# Altium schematic sheet 1_README.schdoc.schdoc
size 309 x 223 mm; Symbol: Sheet-Symbol_A4; Device: Sheet-Symbol_A4; Company: 嘉立创EDA; Version: V1.0; Page Size: A4; @Project Name: 偏控器件; @Page Count: 5; @Update Date: 2025-09-26; @Create Date: 2025-09-18; @Schematic Name: Schematic1; @Page No: 1; @Page Name: README
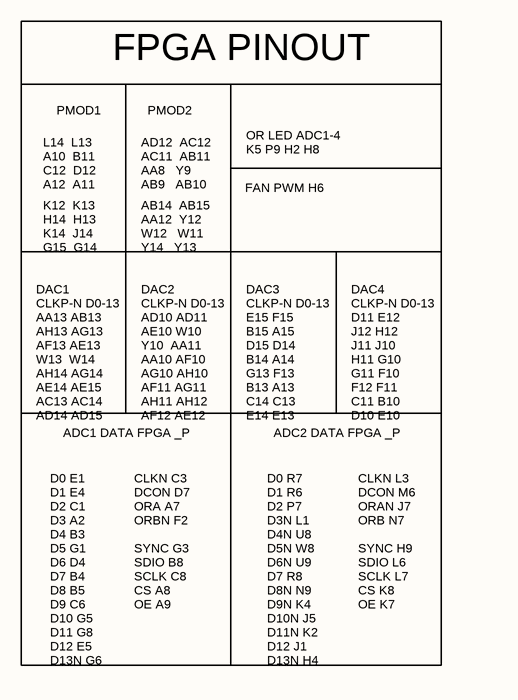
[diagram p0: 1_README.schdoc.schdoc]

## Notes on the sheet
- PMOD1
- FPGA PINOUT
- PMOD2
- L14  L13
  A10  B11
  C12  D12
  A12  A11
- AD12  AC12
  AC11  AB11
  AA8   Y9
  AB9   AB10
- OR LED ADC1-4
  K5 P9 H2 H8
- K12  K13
  H14  H13
  K14  J14
  G15  G14
- AB14  AB15
  AA12  Y12
  W12   W11
  Y14   Y13
- FAN PWM H6
- DAC1
  CLKP-N D0-13
- AA13 AB13
  AH13 AG13
  AF13 AE13
  W13  W14
  AH14 AG14
  AE14 AE15
  AC13 AC14
  AD14 AD15
- DAC2
  CLKP-N D0-13
- AD10 AD11
  AE10 W10
  Y10  AA11
  AA10 AF10
  AG10 AH10
  AF11 AG11
  AH11 AH12
  AF12 AE12
- DAC3
  CLKP-N D0-13
- E15 F15
  B15 A15
  D15 D14
  B14 A14
  G13 F13
  B13 A13
  C14 C13
  E14 E13
- DAC4
  CLKP-N D0-13
- D11 E12
  J12 H12
  J11 J10
  H11 G10
  G11 F10
  F12 F11
  C11 B10
  D10 E10
- ADC1 DATA	FPGA _P
- ADC2 DATA	FPGA _P
- D0	E1
  D1	E4
  D2	C1
  D3	A2
  D4	B3
  D5	G1
  D6	D4
  D7	B4
  D8	B5
  D9	C6
  D10	G5
  D11	G8
  D12	E5
  D13N	G6
- CLKN	C3
  DCON	D7
  ORA	A7
  ORBN	F2
- SYNC	G3
  SDIO	B8
  SCLK	C8
  CS	A8
  OE	A9
- D0	R7
  D1	R6
  D2	P7
  D3N	L1
  D4N	U8
  D5N	W8
  D6N	U9
  D7	R8
  D8N	N9
  D9N	K4
  D10N	J5
  D11N	K2
  D12	J1
  D13N	H4
- CLKN	L3
  DCON	M6
  ORAN	J7
  ORB	N7
- SYNC	H9
  SDIO	L6
  SCLK	L7
  CS	K8
  OE	K7
- 1
- 2
- 3
- 4
- 5
- 6
- A
- B
- C
- 原理图
- Schematic1
- 创建日期
- 更新日期
- 2025-09-26
- 2025-09-18
- 审阅
- 绘制
- 图页
- README
- 物料编码
- 偏控器件
- D
- 版本
- 尺寸
- 页
- 共
- V1.0
- A4
- 嘉立创EDA